# EAGLE schematic ece411-t10-plant-final-schematic (EAGLE 9.2.1)
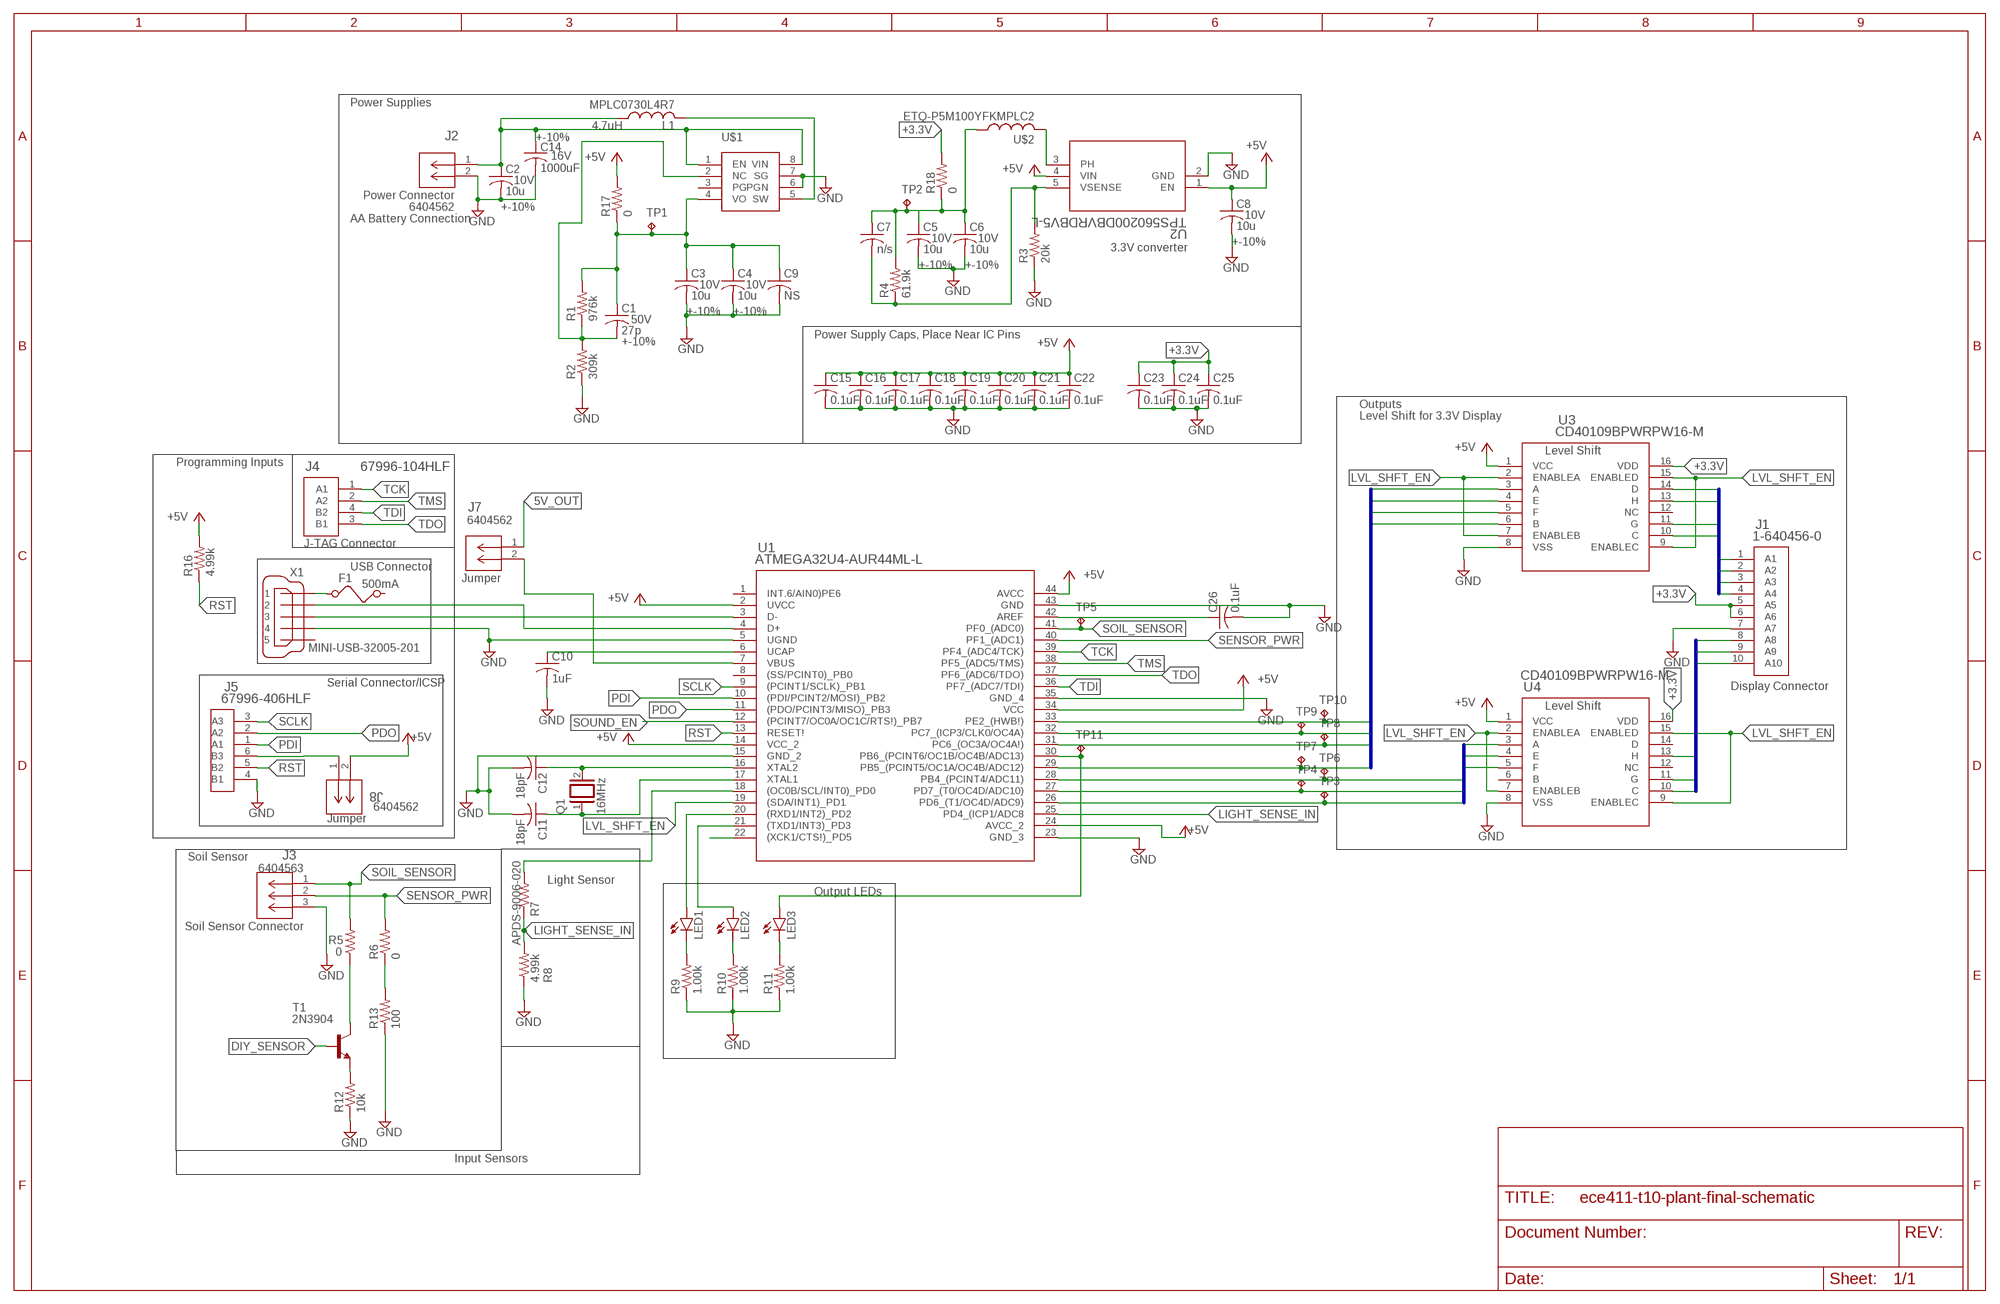
[diagram p0: schematic, sheet 1]

## Parts
C1  27p  C-USC0805K  [C0805K]
C2  10u  C-USC0805K  [C0805K]
C3  10u  C-USC0805K  [C0805K]
C4  10u  C-USC0805K  [C0805K]
C5  10u  C-USC0805K  [C0805K]
C6  10u  C-USC0805K  [C0805K]
C7  n/s  C-USC0805K  [C0805K]
C8  10u  C-USC0805K  [C0805K]
C9  NS  C-USC0603K  [C0603K]
C10  1uF  C-USC0805K  [C0805K]
C11  18pF  C-USC0805K  [C0805K]
C12  18pF  C-USC0805K  [C0805K]
C14  1000uF  C-US050-050X075  [C050-050X075]
C15  0.1uF  C-USC0805  [C0805]
C16  0.1uF  C-USC0805  [C0805]
C17  0.1uF  C-USC0805  [C0805]
C18  0.1uF  C-USC0805  [C0805]
C19  0.1uF  C-USC0805  [C0805]
C20  0.1uF  C-USC0805  [C0805]
C21  0.1uF  C-USC0805  [C0805]
C22  0.1uF  C-USC0805  [C0805]
C23  0.1uF  C-USC0805  [C0805]
C24  0.1uF  C-USC0805  [C0805]
C25  0.1uF  C-USC0805  [C0805]
C26  0.1uF  C-USC0805  [C0805]
F1  500mA  FUSEFUSE1206  [R1206]
J1  1-640456-0  [1-640456-0]
J2  640456-2  [CONN2_640456-2]
J3  640456-3  [CONN3_640456-3]
J4  67996-104HLF  [67996-104HLF]
J5  67996-406HLF  [67996-406HLF]
J7  640456-2  [CONN2_640456-2]
J8  640456-2  [CONN2_640456-2]
L1  MPLC0730L4R7  [MPLC0730L4R7]
LED1  LED3MM  [LED3MM]
LED2  LED3MM  [LED3MM]
LED3  LED3MM  [LED3MM]
Q1  16MHz  XTAL  [Q]
R1  976k  R-US_R0805  [R0805]
R2  309k  R-US_R0805  [R0805]
R3  20k  R-US_R0805  [R0805]
R4  61.9k  R-US_R0805  [R0805]
R5  0  R-US_R0603  [R0603]
R6  0  R-US_R0603  [R0603]
R7  R-US_R1206W  [R1206W]
R8  4.99k  R-US_R1206W  [R1206W]
R9  1.00k  R-US_R0805  [R0805]
R10  1.00k  R-US_R0805  [R0805]
R11  1.00k  R-US_R0805  [R0805]
R12  10k  R-US_M1206  [M1206]
R13  100  R-US_M1206  [M1206]
R16  4.99k  R-US_R1206W  [R1206W]
R17  0  R-US_R0603  [R0603]
R18  0  R-US_R0603  [R0603]
T1  2N3904  [TO92]
TP1  TPPAD1-20  [P1-20]
TP2  TPPAD1-20  [P1-20]
TP3  TPPAD1-20  [P1-20]
TP4  TPPAD1-20  [P1-20]
TP5  TPPAD1-20  [P1-20]
TP6  TPPAD1-20  [P1-20]
TP7  TPPAD1-20  [P1-20]
TP8  TPPAD1-20  [P1-20]
TP9  TPPAD1-20  [P1-20]
TP10  TPPAD1-20  [P1-20]
TP11  TPPAD1-20  [P1-20]
U1  ATMEGA32U4-AUR44ML-L  [44ML-L]
U2  TPS560200DBVRDBV5-L  [DBV5-L]
U3  CD40109BPWRPW16-M  [PW16-M]
U4  CD40109BPWRPW16-M  [PW16-M]
U$1  MCP1642B/D8-MSOP  [MSOP8]
U$2  ETQ-P5M100YFKMPLC2  [PA4346.103ANLT]
X1  MINI-USB-32005-201  [32005-201]

## Nets
5V_OUT: J7.1
+3.3V: C7.1 C23.1 C24.1 C25.1 J1.5(A5) J1.6(A6) R4.2 TP2.TP U3.16(VDD) U4.16(VDD)
AREF: C26.1 U1.42(AREF)
DISP_1: TP10.TP U1.33(PE2_(HWB!)) U3.3(A)
DISP_2: TP9.TP U1.32(PC7_(ICP3/CLK0/OC4A)) U3.4(E)
DISP_3: TP8.TP U1.31(PC6_(OC3A/OC4A!)) U3.5(F)
DISP_5: TP6.TP U1.28(PB4_(PCINT4/ADC11)) U4.3(A)
DISP_6: TP4.TP U1.27(PD7_(T0/OC4D/ADC10)) U4.4(E)
DISP_7: TP3.TP U1.26(PD6_(T1/OC4D/ADC9)) U4.5(F)
DIY_SENSOR: T1.2(B)
GND: C2.2 C3.2 C4.2 C5.2 C6.2 C8.2 C9.2 C10.2 C11.2 C12.2 C14.2 C15.2 C16.2 C17.2 C18.2 C19.2 C20.2 C21.2 C22.2 C23.2 C24.2 C25.2 C26.2 J1.7(A7) J2.2 J3.3 J5.4(B1) R2.1 R3.1 R8.1 R9.1 R10.1 R11.1 R12.1 R13.1 U1.15(GND_2) U1.23(GND_3) U1.35(GND_4) U1.43(GND) U2.2(GND) U3.8(VSS) U4.8(VSS) U$1.6(PGN) U$1.7(SG)
LIGHT_SENSE_IN: R7.1 R8.2 U1.25(PD4_(ICP1/ADC8)
LIGHT_SENSE_PWR: R7.2 U1.18((OC0B/SCL/INT0)_PD0)
LVL_SHFT_EN: U1.19((SDA/INT1)_PD1) U3.2(ENABLEA) U3.7(ENABLEB) U3.9(ENABLEC) U3.15(ENABLED) U4.2(ENABLEA) U4.7(ENABLEB) U4.9(ENABLEC) U4.15(ENABLED)
N$1: U2.3(PH) U$2.P$2
N$2: L1.2 U$1.5(SW)
N$3: C7.2 R3.2 R4.1 U2.5(VSENSE)
N$4: U1.5(UGND) X1.4 ; supply symbol labelled GND
N$5: C12.1 Q1.2 U1.16(XTAL2)
N$7: TP7.TP U1.29(PB5_(PCINT5/OC1A/OC4B/ADC12)) U3.6(B)
N$8: C11.1 Q1.1 U1.17(XTAL1)
N$9: U1.4(D+) X1.2
N$10: U1.3(D-) X1.3
N$11: F1.1 X1.1
N$12: LED3.K(C) R11.2
N$13: C1.1 C3.1 C4.1 C9.1 R1.2 R17.1 TP1.TP U$1.4(VO)
N$14: J1.8(A8) U4.10(C)
N$15: J1.9(A9) U4.11(G)
N$16: C10.1 U1.6(UCAP)
N$17: J1.1(A1) U3.14(D)
N$18: LED2.K(C) R10.2
N$19: J5.6(B3) J8.1
N$20: LED1.K(C) R9.2
N$21: R5.1 T1.1(C)
N$22: R12.2 T1.3(E)
N$23: LED1.A U1.20((RXD1/INT2)_PD2)
N$24: LED2.A U1.21((TXD1/INT3)_PD3)
N$25: LED3.A TP11.TP U1.30(PB6_(PCINT6/OC1B/OC4B/ADC13))
N$26: R6.1 R13.2
N$27: J1.2(A2) U3.13(H)
N$28: J1.3(A3) U3.11(G)
N$29: J1.4(A4) U3.10(C)
N$30: J1.10(A10) U4.13(H)
N$31: R18.2
N$32: C5.1 C6.1 R18.1 U$2.P$1
N$33: U1.22((XCK1/CTS!)_PD5)
PDI: J5.1(A1) U1.10((PDI/PCINT2/MOSI)_PB2)
PDO: J5.2(A2) U1.11((PDO/PCINT3/MISO)_PB3)
RST: J5.5(B2) R16.1 U1.13(RESET!)
SCLK: J5.3(A3) U1.9((PCINT1/SCLK)_PB1)
SENSOR_PWR: J3.2 R6.2 U1.40(PF1_(ADC1))
SOIL_SENSOR: J3.1 R5.2 TP5.TP U1.41(PF0_(ADC0))
SOUND_EN: U1.12((PCINT7/OC0A/OC1C/RTS!)_PB7)
SWITCH: C2.1 C14.1 J2.1 L1.1 U$1.1(EN) U$1.8(VIN)
TCK: J4.1(A1) U1.39(PF4_(ADC4/TCK))
TDI: J4.4(B2) U1.36(PF7_(ADC7/TDI))
TDO: J4.3(B1) U1.37(PF6_(ADC6/TDO))
TMS: J4.2(A2) U1.38(PF5_(ADC5/TMS))
VBUS: J7.2 U1.7(VBUS)
VCC: C8.1 C15.1 C16.1 C17.1 C18.1 C19.1 C20.1 C21.1 C22.1 J8.2 R16.2 R17.2 U1.2(UVCC) U1.14(VCC_2) U1.24(AVCC_2) U1.34(VCC) U1.44(AVCC) U2.1(EN) U2.4(VIN) U3.1(VCC) U4.1(VCC) ; supply symbol labelled +5V
VFB: C1.2 R1.1 R2.2 U$1.2(NC)
Unconnected: F1.2 U1.1(INT.6/AIN0)PE6) U1.8((SS/PCINT0)_PB0) U3.12(NC) U4.6(B) U4.12(NC) U4.14(D) U$1.3(PG) X1.5

## Buses
DISP_1,DISP_2,DISP_3,DISP_4,N$7
DISP_5,DISP_6,DISP_7
N$17,N$27,N$28,N$29
N$14,N$15,N$30

## Notes on the sheet
- Power Supplies
- AA Battery Connection
- Power Supply Caps, Place Near IC Pins
- Outputs
- Level Shift for 3.3V Display
- Programming Inputs
- J-TAG Connector
- USB Connector
- Serial Connector/ICSP
- Display Connector
- Soil Sensor
- Light Sensor
- Output LEDs
- Input Sensors

## Library data of the parts
C1 = rcl:C-US: CAPACITOR, American symbol; COST: 0.16; DESCRIPTION: Ceramic FB Cap; DISTRIBUTER: Arrow; DIST_PART_NUMBER: C0805C270J1GACTU; MANUFACTURER: KEMET; MFG_PART_NUMBER: C0805C270J1GACTU; PACKAGE: 0805; PART_NUMBER: C0805C270J1GACTU; SPICEPREFIX: C; TOL: +-10%; VOLTAGE: 50V
C2-C6 C8 = rcl:C-US: CAPACITOR, American symbol; COST: 0.27; DESCRIPTION: Ceramic Output Capacitor; DISTRIBUTER: Arrow; DIST_PART_NUMBER: GRM21BR61D106ME15L; MANUFACTURER: Murata; MFG_PART_NUMBER: GRM21BR61D106ME15L; PACKAGE: 0805; PART_NUMBER: GRM21BR61D106ME15L; SPICEPREFIX: C; TOL: +-10%; VOLTAGE: 10V
C7 C9 = rcl:C-US: CAPACITOR, American symbol; SPICEPREFIX: C
C10 = rcl:C-US: CAPACITOR, American symbol; COST: 0.2; DESCRIPTION: Bypass Capacitor; DISTRIBUTER: Arrow; DIST_PART_NUMBER: LMK212BJ105KD-T; MANUFACTURER: Taiyo Yuden; MFG_PART_NUMBER: LMK212BJ105KD-T; PACKAGE: 0805; PART_NUMBER: LMK212BJ105KD-T; SPICEPREFIX: C
C11 C12 = rcl:C-US: CAPACITOR, American symbol; COST: 0.31; DESCRIPTION: Crystal Capacitor; DISTRIBUTER: Arrow; DIST_PART_NUMBER: GRM21A5C2E180JW01D; MANUFACTURER: Murata; MFG_PART_NUMBER: GRM21A5C2E180JW01D; PACKAGE: 0805; PART_NUMBER: GRM21A5C2E180JW01D; SPICEPREFIX: C
C14 = rcl:C-US: CAPACITOR, American symbol; COST: 0.36; DESCRIPTION: Input Cap; DISTRIBUTER: Arrow; DIST_PART_NUMBER: EEU-FS1A102B; MANUFACTURER: Panasonic; MFG_PART_NUMBER: EEU-FS1A102B; PACKAGE: Radial; PART_NUMBER: EEU-FS1A102B; SPICEPREFIX: C; TOL: +-10%; VOLTAGE: 16V
C15-C26 = rcl:C-US: CAPACITOR, American symbol; COST: 0.35; DESCRIPTION: Power Supply Caps; DISTRIBUTER: Arrow; DIST_PART_NUMBER: C0805C104K6RACTU; MANUFACTURER: KEMET; MFG_PART_NUMBER: C0805C104K6RACTU; PACKAGE: 0805; PART_NUMBER: C0805C104K6RACTU; SPICEPREFIX: C
F1 = ECE411:FUSE; COST: 0.82; DESCRIPTION: 500mA Fuse; DISTRIBUTER: Arrow; DIST_PART_NUMBER: CC12H500MA-TR; MANUFACTURER: Eaton; MFG_PART_NUMBER: CC12H500MA-TR; PACKAGE: 1206; PART_NUMBER: CC12H500MA-TR
J1 = ECE411:1-640456-0; COST: 0.27; DESCRIPTION: Display Connector; DISTRIBUTER: Arrow; DIST_PART_NUMBER: 1-640456-0; MANUFACTURER: TE; MANUFACTURER_PART_NUMBER: 16404560; MFG_PART_NUMBER: 1-640456-0; PACKAGE: 10 POS 2.54mm; PART_NUMBER: 1-640456-0; VENDOR: TE Connectivity
J2 = ECE411:640456-2; COMMENT: Power Connector; COST: 0.1; DESCRIPTION: 2 Pin Header; DISTRIBUTER: Arrow; DIST_PART_NUMBER: 640456-2; MANUFACTURER: TE; MANUFACTURER_PART_NUMBER: 6404562; MFG_PART_NUMBER: 640456-2; PACKAGE: HDR 2 POS 2.54mm; PART_NUMBER: 640456-2; VENDOR: TE Connectivity
J3 = ECE411:640456-3; COST: 0.11; DESCRIPTION: Soil Sensor Connector; DISTRIBUTER: Arrow; DIST_PART_NUMBER: 640456-3; MANUFACTURER: TE-Connectivity; MANUFACTURER_PART_NUMBER: 6404563; MFG_PART_NUMBER: 640456-3; NOTE: Soil Sensor Connector; PACKAGE: HDR 3 POS 2.54mm; PART_NUMBER: 640456-3; VENDOR: TE Connectivity
J4 = ECE411:67996-104HLF; COST: 0.21; DESCRIPTION: Jtag Header; DISTRIBUTER: Arrow; DIST_PART_NUMBER: 67996-404HLF; MANUFACTURER: Amphenol; MANUFACTURER_PART_NUMBER: 67996104HLF; MFG_PART_NUMBER: 67996-404HLF; PACKAGE: HDR 4 POS 2.54mm; PART_NUMBER: 67996-404HLF; VENDOR: Amphenol FCI
J5 = ECE411:67996-406HLF; COST: 0.3; DESCRIPTION: Serial Connector; DISTRIBUTER: Arrow; DIST_PART_NUMBER: 67996-406HLF; MANUFACTURER: Amphenol; MANUFACTURER_PART_NUMBER: 67996406HLF; MFG_PART_NUMBER: 67996-406HLF; PACKAGE: HDR 6 POS 2.54mm; PART_NUMBER: 67996-406HLF; VENDOR: Amphenol FCI
J7 = ECE411:640456-2; COMMENT: Jumper; COST: 0.1; DESCRIPTION: Jumper; DISTRIBUTER: Arrow; DIST_PART_NUMBER: 640456-2; MANUFACTURER: TE; MANUFACTURER_PART_NUMBER: 6404562; MFG_PART_NUMBER: 640456-2; PACKAGE: HDR 2 POS 2.54mm; PART_NUMBER: 640456-2; VENDOR: TE Connectivity
J8 = ECE411:640456-2; COMMENT: Jumper; COST: 0.1; DESCRIPTION: 2 Pin Header; DISTRIBUTER: Arrow; DIST_PART_NUMBER: 640456-2; MANUFACTURER: TE; MANUFACTURER_PART_NUMBER: 6404562; MFG_PART_NUMBER: 640456-2; PACKAGE: HDR 2 POS 2.54mm; PART_NUMBER: 640456-2; VENDOR: TE Connectivity
L1 = ECE411:MPLC0730L4R7; COST: 1.11; DESCRIPTION: Boost Inductor; DISTRIBUTER: Arrow; DIST_PART_NUMBER: NPIM74C4R7MTRF; MANUFACTURER: NIC Componenets; MFG_PART_NUMBER: NPIM74C4R7MTRF; PACKAGE: Shielded; PART_NUMBER: NPIM74C4R7MTRF; VALUES: 4.7uH
LED1-LED3 = led:LED: LED OSRAM: - CHIPLED LG R971, LG N971, LY N971, LG Q971, LY Q971, LO R971, LY R971 LH N974, LH R974 LS Q976, LO Q976, LY Q976 LO Q996 - Hyper CHIPLED LW Q18S LB Q993, LB Q99A, LB R99A - SideLED LS A670, LO A670, LY A670, LG A670, LP A670 LB A673, LV A673, LT A673, LW A673 LH A674 LY A675 LS A676, LA A676, LO A676, LY A676, LW A676 LS A679, LY A679, LG A679 - Hyper Micro SIDELED® LS Y876, LA Y876, LO Y876, LY Y876 LT Y87S - SmartLED LW L88C, LW L88S LB L89C, LB L89S, LG L890 LS L89K, LO L89K, LY L89K LS L896, LA L896, LO L896, LY L896 - TOPLED LS T670, LO T670, LY T670, LG T670, LP T670 LSG T670, LSP T670, LSY T670, LOP T670, LYG T670 LG T671, LOG T671, LSG T671 LB T673, LV T673, LT T673, LW T673 LH T674 LS T676, LA T676, LO T676, LY T676, LB T676, LH T676, LSB T676, LW T676 LB T67C, LV T67C, LT T67C, LS T67K, LO T67K, LY T67K, LW E67C LS E67B, LA E67B, LO E67B, LY E67B, LB E67C, LV E67C, LT E67C LW T67C LS T679, LY T679, LG T679 LS T770, LO T770, LY T770, LG T770, LP T770 LB T773, LV T773, LT T773, LW T773 LH T774 LS E675, LA E675, LY E675, LS T675 LS T776, LA T776, LO T776, LY T776, LB T776 LHGB T686 LT T68C, LB T68C - Hyper Mini TOPLED® LB M676 - Mini TOPLED Santana® LG M470 LS M47K, LO M47K, LY M47K Source: http://www.osram.convergy.de LUXEON: - LUMILED® LXK2-PW12-R00, LXK2-PW12-S00, LXK2-PW14-U00, LXK2-PW14-V00 LXK2-PM12-R00, LXK2-PM12-S00, LXK2-PM14-U00 LXK2-PE12-Q00, LXK2-PE12-R00, LXK2-PE12-S00, LXK2-PE14-T00, LXK2-PE14-U00 LXK2-PB12-K00, LXK2-PB12-L00, LXK2-PB12-M00, LXK2-PB14-N00, LXK2-PB14-P00, LXK2-PB14-Q00 LXK2-PR12-L00, LXK2-PR12-M00, LXK2-PR14-Q00, LXK2-PR14-R00 LXK2-PD12-Q00, LXK2-PD12-R00, LXK2-PD12-S00 LXK2-PH12-R00, LXK2-PH12-S00 LXK2-PL12-P00, LXK2-PL12-Q00, LXK2-PL12-R00 Source: www.luxeon.com KINGBRIGHT: KA-3528ASYC Source: www.kingbright.com; COST: 0.33; DESCRIPTION: LED Indicator; DISTRIBUTER: Arrow; DIST_PART_NUMBER: WP7113SRD/J4; MANUFACTURER: Kingbright; MFG_PART_NUMBER: WP7113SRD/J4; PACKAGE: 2-Pin T-1 3/4; PART_NUMBER: WP7113SRD/J4
Q1 = special:XTAL: CRYSTAL; COST: 0.28; DESCRIPTION: Crystal Oscilator; DISTRIBUTER: Arrow; DIST_PART_NUMBER: FC4STCBAF16.0-BAG200; MANUFACTURER: Fox Electronics; MFG_PART_NUMBER: FC4STCBAF16.0-BAG200; PACKAGE: Thru-Hole Crystal; PART_NUMBER: FC4STCBAF16.0-BAG200
R1 = rcl:R-US_: RESISTOR, American symbol; COST: 0.32; DESCRIPTION: Feedback Resistor 1; DISTRIBUTER: Arrow; DIST_PART_NUMBER: ERA-6AEB9763V; MANUFACTURER: Panasonic; MFG_PART_NUMBER: ERA-6AEB9763V; PACKAGE: 0805; PART_NUMBER: ERA-6AEB9763V; SPICEPREFIX: R
R2 = rcl:R-US_: RESISTOR, American symbol; COST: 0.32; DESCRIPTION: Feedback Resistor 2; DISTRIBUTER: Arrow; DIST_PART_NUMBER: ERA-6AEB3093V; MANUFACTURER: Panasonic; MFG_PART_NUMBER: ERA-6AEB3093V; PACKAGE: 0805; PART_NUMBER: ERA-6AEB3093V; SPICEPREFIX: R
R3 = rcl:R-US_: RESISTOR, American symbol; COST: 0.332; DESCRIPTION: Buck Feedback Res 2; DISTRIBUTER: Arrow; DIST_PART_NUMBER: ERA6AEB203V; MANUFACTURER: Panasonic; MFG_PART_NUMBER: ERA6AEB203V; PACKAGE: 0805; PART_NUMBER: ERA6AEB203V; SPICEPREFIX: R
R4 = rcl:R-US_: RESISTOR, American symbol; COST: 0.09; DESCRIPTION: Buck Feedback Res 1; DISTRIBUTER: Arrow; DIST_PART_NUMBER: RC2012F6192CS; MANUFACTURER: Samsung; MFG_PART_NUMBER: RC2012F6192CS; PACKAGE: 0805; PART_NUMBER: RC2012F6192CS; SPICEPREFIX: R
R5 R6 R17 R18 = rcl:R-US_: RESISTOR, American symbol; COST: 0.09; DESCRIPTION: 0 Ohm Jumpers; DISTRIBUTER: Arrow; DIST_PART_NUMBER: CRCW08050000Z0EBC; MANUFACTURER: Vishay; MFG_PART_NUMBER: CRCW08050000Z0EBC; PACKAGE: 0805; PART_NUMBER: CRCW08050000Z0EBC; SPICEPREFIX: R
R7 = rcl:R-US_: RESISTOR, American symbol; COST: 1.66; DESCRIPTION: Light Sensor; DISTRIBUTER: Digi-key; DIST_PART_NUMBER: 516-1718-1-ND; MANUFACTURER: Broadcom Limited; MFG_PART_NUMBER: APDS-9006-020; PACKAGE: 1206; PARTNUMBER: APDS-9006-020; PART_NUMBER: APDS-9006-020; SPICEPREFIX: R
R8 R16 = rcl:R-US_: RESISTOR, American symbol; COST: 0.52; DESCRIPTION: Light Sensor Resistor; DISTRIBUTER: Arrow; DIST_PART_NUMBER: ERJ-PB6B4991V; MANUFACTURER: Panasonic; MFG_PART_NUMBER: ERJ-PB6B4991V; PACKAGE: 0805; PART_NUMBER: ERJ-PB6B4991V; SPICEPREFIX: R
R9-R11 = rcl:R-US_: RESISTOR, American symbol; COST: 0.09; DESCRIPTION: RC Filter Resistance; DISTRIBUTER: Arrow; DIST_PART_NUMBER: CRGH0805J1K0; MANUFACTURER: TE Connectivity; MFG_PART_NUMBER: CRGH0805J1K0; PACKAGE: 0805; PART_NUMBER: CRGH0805J1K0; SPICEPREFIX: R
R12 = rcl:R-US_: RESISTOR, American symbol; COST: 0.09; DESCRIPTION: Soil Sensor Resistor 2; DISTRIBUTER: Arrow; DIST_PART_NUMBER: CRGH0805J10K; MANUFACTURER: Vishay; MFG_PART_NUMBER: CRGH0805J10K; PACKAGE: 0805; PART_NUMBER: CRGH0805J10K; SPICEPREFIX: R
R13 = rcl:R-US_: RESISTOR, American symbol; COST: 0.09; DESCRIPTION: Soil Sensor Resistor; DISTRIBUTER: Arrow; DIST_PART_NUMBER: CRCW0805100RFKEAC; MANUFACTURER: Vishay; MFG_PART_NUMBER: CRCW0805100RFKEAC; PACKAGE: 0805; PART_NUMBER: CRCW0805100RFKEAC; SPICEPREFIX: R
T1 = transistor:2N3904: NPN TRANSISTOR; COST: 0.25; DESCRIPTION: Soil Sensor Transistor; DISTRIBUTER: Arrow; DIST_PART_NUMBER: 2N3904TF; MANUFACTURER: ON Semiconductor; MFG_PART_NUMBER: 2N3904TF; PACKAGE: TO-92; PART_NUMBER: 2N3904RLRPG
TP1-TP11 = testpad:TP: Test pad
U1 = ECE411:ATMEGA32U4-AUR; MANUFACTURER_PART_NUMBER: ATMEGA32U4AUR; VENDOR: Atmel
U2 = ECE411:TPS560200DBVR; MANUFACTURER_PART_NUMBER: TPS560200DBVR; NOTE: 3.3V converter; VENDOR: Texas Instruments
U3 U4 = ECE411:CD40109BPWR; COST: 0.29; DESCRIPTION: Level Shift; DISTRIBUTER: Arrow; DIST_PART_NUMBER: CD40109BPW; MANUFACTURER: TE; MANUFACTURER_PART_NUMBER: CD40109BPWR; MFG_PART_NUMBER: CD40109BPW; PACKAGE: 16-Pin SOP; PART_NUMBER: CD40109BPW; VENDOR: Vendor
U$1 = ECE411:MCP1642B/D; COST: 0.91; DESCRIPTION: 5V Power Converter; DISTRIBUTER: Arrow; DIST_PART_NUMBER: MCP1642B-50I/MS; MANUFACTURER: Microchip; MFG_PART_NUMBER: MCP1642B-50I/MS; PACKAGE: 8-Pin MSOP; PART_NUMBER: MCP1642B-50I/MS
U$2 = ECE411:ETQ-P5M100YFK
X1 = con-cypressindustries:MINI-USB-: MINI USB-B Conector Source: www.cypressindustries.com; COST: 0.67; DESCRIPTION: USB Connector; DISTRIBUTER: Arrow; DIST_PART_NUMBER: UJ2-MABH-2-SMT-TR; MANUFACTURER: CUI Inc; MFG_PART_NUMBER: UJ2-MABH-2-SMT-TR; OC_FARNELL: unknown; OC_NEWARK: unknown; PACKAGE: 5 POS 0.8mm Solder; PART_NUMBER: UJ2-MABH-2-SMT-TR